# Altium schematic sheet Sheet2.SchDoc
size A4
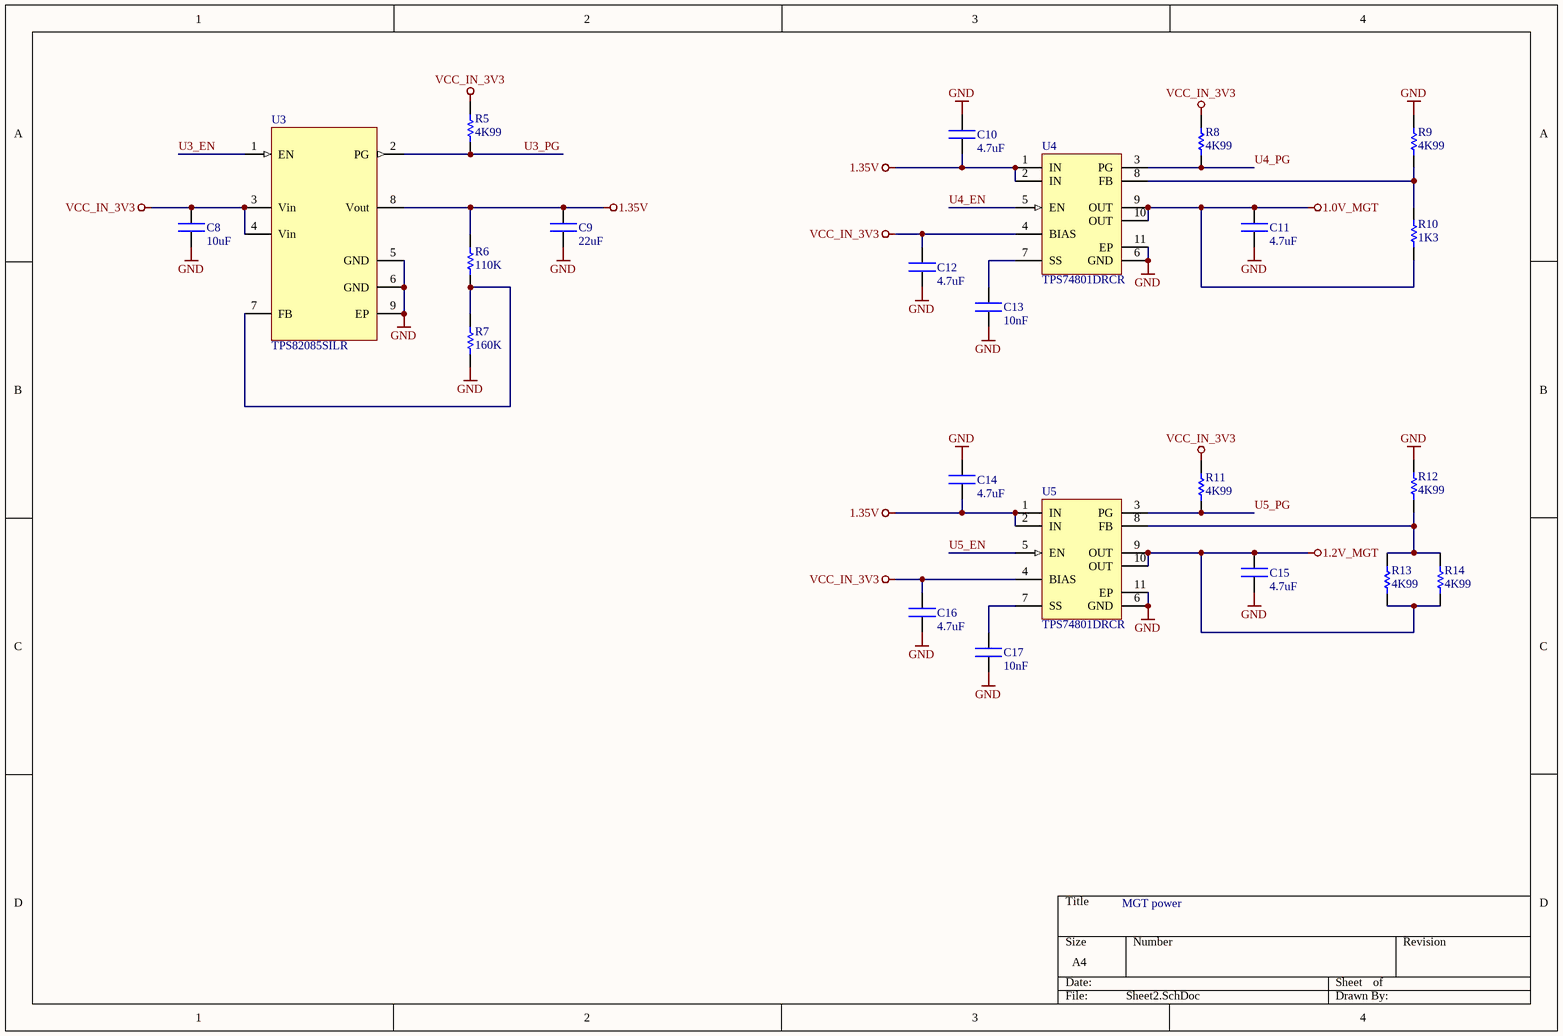
[diagram p0: Sheet2.SchDoc]

## Parts
C8  10uF  [CAPC1608X08N]
C9  22uF  [CAPC1608X08N]
C10  4.7uF  [CAPC1005X05N]
C11  4.7uF  [CAPC1005X05N]
C12  4.7uF  [CAPC1005X05N]
C13  10nF  [CAPC1005X05N]
C14  4.7uF  [CAPC1005X05N]
C15  4.7uF  [CAPC1005X05N]
C16  4.7uF  [CAPC1005X05N]
C17  10nF  [CAPC1005X05N]
R5  4K99  [RESC1005X05N]
R6  110K  [RESC1005X05N]
R7  160K  [RESC1005X05N]
R8  4K99  [RESC1005X05N]
R9  4K99  [RESC1005X05N]
R10  1K3  [RESC1005X05N]
R11  4K99  [RESC1005X05N]
R12  4K99  [RESC1005X05N]
R13  4K99  [RESC1005X05N]
R14  4K99  [RESC1005X05N]
U3  TPS82085SILR  [TPS82085SILR]
U4  TPS74801DRCR  [TPS74801DRCR]
U5  TPS74801DRCR  [TPS74801DRCR]

## Nets
1.0V_MGT: C11.2 R10.2 U4.9(OUT) U4.10(OUT)
1.2V_MGT: C15.2 R13.1 R14.1 U5.9(OUT) U5.10(OUT)
1.35V: C9.2 C10.2 C14.2 R6.2 U3.8(Vout) U4.1(IN) U4.2(IN) U5.1(IN) U5.2(IN)
GND: C8.1 C9.1 C10.1 C11.1 C12.1 C13.1 C14.1 C15.1 C16.1 C17.1 R7.1 R9.2 R12.1 U3.5(GND) U3.6(GND) U3.9(EP) U4.6(GND) U4.11(EP) U5.6(GND) U5.11(EP)
VCC_IN_3V3: C8.2 C12.2 C16.2 R5.2 R8.2 R11.2 U3.3(Vin) U3.4(Vin) U4.4(BIAS) U5.4(BIAS)
U3_EN: U3.1(EN)
U3_PG: R5.1 U3.2(PG)
U4_EN: U4.5(EN)
U4_PG: R8.1 U4.3(PG)
U5_EN: U5.5(EN)
U5_PG: R11.1 U5.3(PG)
NetC13_2: C13.2 U4.7(SS)
NetC17_2: C17.2 U5.7(SS)
NetR6_1: R6.1 R7.2 U3.7(FB)
NetR9_1: R9.1 R10.1 U4.8(FB)
NetR12_2: R12.2 R13.2 R14.2 U5.8(FB)

## Notes on the sheet
- MGT power

## Library data of the parts
C8 C9 = C0603: Ceramic Chip Capacitor
  C8: Value: 10uF
  C9: Value: 22uF
C10-C17 = C0402: Ceramic Chip Capacitor
  C10-C12 C14-C16: Value: 4.7uF
  C13 C17: Value: 10nF
R5-R14 = R0402: Ceramic Chip Resistor
  R5 R8 R9 R11-R14: Value: 4K99
  R6: Value: 110K
  R7: Value: 160K
  R10: Value: 1K3
U3 = TPS82085SILR: 3-A High Efficiency Step-Down Converter
U4 U5 = TPS74801DRCR: Single Output LDO, 1.5 A, Adjustable 0.8 to 3.6 V Output, 0.8 to 5.5 V Input, with Programmable Soft Start, 10-pin SON (DRC), -40 to 125 degC, Green (RoHS & no Sb/Br); Manufacturer: Texas Instruments; Accuracy(%): 2; Iout(Max)(A): 1.5; Iq(Typ)(mA): 1; Power Good: TRUE; Rating: Catalog; SubFamily: Single Channel LDO; Vdo(Typ)(mV): 60; Vin(Max)(V): 5.5; Vin(Min)(V): 0.8; Vout Adj(Max)(V): 3.6; DatasheetVersion: SBVS074J; PackageVersion: 4204102-3/L; PackageReference: DRC10-2400X1650TP; PackageDescription: 10-Pin Plastic Small Outline, Body 3 x 3 mm, Pitch 0.5 mm; Supplier 1: Digi-Key; Supplier Part Number 1: 296-21563-2-ND; Supplier 2: Digi-Key; Supplier Part Number 2: 296-21563-1-ND; Supplier 3: Digi-Key; Supplier Part Number 3: 296-21563-6-ND; Supplier 4: Newark; Supplier Part Number 4: 30M1868; Supplier 5: Mouser; Supplier Part Number 5: 595-TPS74801DRCR; Eco-Plan: Green (RoHS & no Sb/Br); Vout Adj(Min)(V): 0.8; Mounting Technology: Surface Mount; PartNumber: TPS74801DRCR; ComponentLink1Description: Manufacturer URL; ComponentLink1URL: http://www.ti.com/; ComponentLink2Description: Datasheet; ComponentLink2URL: http://www.ti.com/general/docs/lit/getliterature.tsp?genericPartNumber=TPS74801&fileType=pdf; ComponentLink3Description: Package Specification; ComponentLink3URL: http://www.ti.com/litv/pdf/mpds117k; ComponentLink4Description: URL Link1; ComponentLink4URL: Samples URL:http://www.ti.com/product/tps74801#samples